# Altium schematic sheet Connection_of_encoders.SchDoc
size A4; SheetNumber: 3; SheetTotal: 6
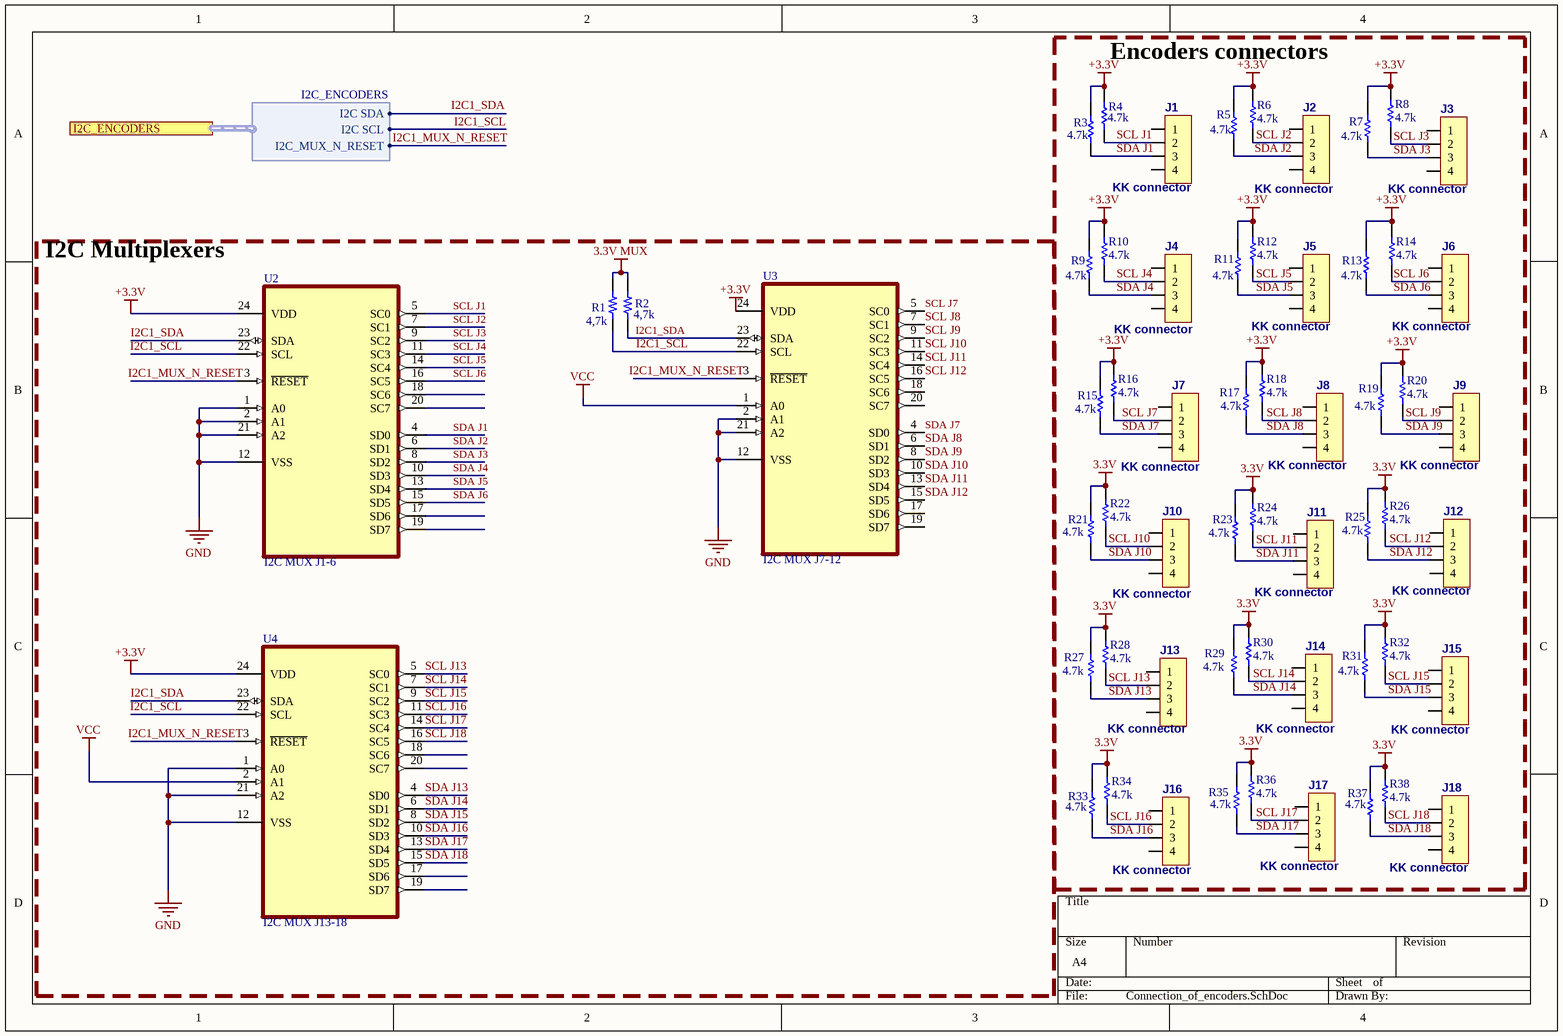
[diagram p0: Connection_of_encoders.SchDoc]

## Parts
J1  KK connector  [KK/2.54/4]
J2  KK connector  [KK/2.54/4]
J3  KK connector  [KK/2.54/4]
J4  KK connector  [KK/2.54/4]
J5  KK connector  [KK/2.54/4]
J6  KK connector  [KK/2.54/4]
J7  KK connector  [KK/2.54/4]
J8  KK connector  [KK/2.54/4]
J9  KK connector  [KK/2.54/4]
J10  KK connector  [KK/2.54/4]
J11  KK connector  [KK/2.54/4]
J12  KK connector  [KK/2.54/4]
J13  KK connector  [KK/2.54/4]
J14  KK connector  [KK/2.54/4]
J15  KK connector  [KK/2.54/4]
J16  KK connector  [KK/2.54/4]
J17  KK connector  [KK/2.54/4]
J18  KK connector  [KK/2.54/4]
R1  4,7k  [RES 0603_1608]
R2  4,7k  [RES 0603_1608]
R3  4.7k  [RESC1609X50X30ML10T20]
R4  4.7k  [RESC1609X50X30ML10T20]
R5  4.7k  [RESC1609X50X30ML10T20]
R6  4.7k  [RESC1609X50X30ML10T20]
R7  4.7k  [RESC1609X50X30ML10T20]
R8  4.7k  [RESC1609X50X30ML10T20]
R9  4.7k  [RESC1609X50X30ML10T20]
R10  4.7k  [RESC1609X50X30ML10T20]
R11  4.7k  [RESC1609X50X30ML10T20]
R12  4.7k  [RESC1609X50X30ML10T20]
R13  4.7k  [RESC1609X50X30ML10T20]
R14  4.7k  [RESC1609X50X30ML10T20]
R15  4.7k  [RESC1609X50X30ML10T20]
R16  4.7k  [RESC1609X50X30ML10T20]
R17  4.7k  [RESC1609X50X30ML10T20]
R18  4.7k  [RESC1609X50X30ML10T20]
R19  4.7k  [RESC1609X50X30ML10T20]
R20  4.7k  [RESC1609X50X30ML10T20]
R21  4.7k  [RESC1609X50X30ML10T20]
R22  4.7k  [RESC1609X50X30ML10T20]
R23  4.7k  [RESC1609X50X30ML10T20]
R24  4.7k  [RESC1609X50X30ML10T20]
R25  4.7k  [RESC1609X50X30ML10T20]
R26  4.7k  [RESC1609X50X30ML10T20]
R27  4.7k  [RESC1609X50X30ML10T20]
R28  4.7k  [RESC1609X50X30ML10T20]
R29  4.7k  [RESC1609X50X30ML10T20]
R30  4.7k  [RESC1609X50X30ML10T20]
R31  4.7k  [RESC1609X50X30ML10T20]
R32  4.7k  [RESC1609X50X30ML10T20]
R33  4.7k  [RESC1609X50X30ML10T20]
R34  4.7k  [RESC1609X50X30ML10T20]
R35  4.7k  [RESC1609X50X30ML10T20]
R36  4.7k  [RESC1609X50X30ML10T20]
R37  4.7k  [RESC1609X50X30ML10T20]
R38  4.7k  [RESC1609X50X30ML10T20]
U2  I2C MUX J1-6  [SOP65P640X110-24N]
U3  I2C MUX J7-12  [SOP65P640X110-24N]
U4  I2C MUX J13-18  [SOP65P640X110-24N]

## Blocks framed on the sheet
Encoders connectors: J1-J18 R3-R38
I2C Multiplexers: R1 R2 U2-U4

## Ports
I2C_ENCODERS (harness I2C_ENCODERS, see Schield_elkapod[2B], Logic_controller[1B])

## Harnesses
I2C_ENCODERS: I2C SDA, I2C SCL, I2C_MUX_N_RESET

## Nets
3.3V: R21.2 R22.2 R23.2 R24.2 R25.2 R26.2 R27.2 R28.2 R29.2 R30.2 R31.2 R32.2 R33.2 R34.2 R35.2 R36.2 R37.2 R38.2
3.3V MUX: R1.1 R2.1
+3.3V: R3.2 R4.2 R5.2 R6.2 R7.2 R8.2 R9.2 R10.2 R11.2 R12.2 R13.2 R14.2 R15.2 R16.2 R17.2 R18.2 R19.2 R20.2 U2.24(VDD) U3.24(VDD) U4.24(VDD)
GND: U2.1(A0) U2.2(A1) U2.12(VSS) U2.21(A2) U3.2(A1) U3.12(VSS) U3.21(A2) U4.1(A0) U4.12(VSS) U4.21(A2)
VCC: U3.1(A0) U4.2(A1)
I2C1_MUX_N_RESET: U2.3(~{RESET}) U3.3(~{RESET}) U4.3(~{RESET}) ; port I2C_ENCODERS.I2C_MUX_N_RESET
I2C1_SCL: R1.2 U2.22(SCL) U3.22(SCL) U4.22(SCL) ; port I2C_ENCODERS.I2C SCL
I2C1_SDA: R2.2 U2.23(SDA) U3.23(SDA) U4.23(SDA) ; port I2C_ENCODERS.I2C SDA
SCL J1: J1.2 R4.1 U2.5(SC0)
SCL J2: J2.2 R6.1 U2.7(SC1)
SCL J3: J3.2 R8.1 U2.9(SC2)
SCL J4: J4.2 R10.1 U2.11(SC3)
SCL J5: J5.2 R12.1 U2.14(SC4)
SCL J6: J6.2 R14.1 U2.16(SC5)
SCL J7: J7.2 R16.1 U3.5(SC0)
SCL J8: J8.2 R18.1 U3.7(SC1)
SCL J9: J9.2 R20.1 U3.9(SC2)
SCL J10: J10.2 R22.1 U3.11(SC3)
SCL J11: J11.2 R24.1 U3.14(SC4)
SCL J12: J12.2 R26.1 U3.16(SC5)
SCL J13: J13.2 R28.1 U4.5(SC0)
SCL J14: J14.2 R30.1 U4.7(SC1)
SCL J15: J15.2 R32.1 U4.9(SC2)
SCL J16: J16.2 R34.1 U4.11(SC3)
SCL J17: J17.2 R36.1 U4.14(SC4)
SCL J18: J18.2 R38.1 U4.16(SC5)
SDA J1: J1.3 R3.1 U2.4(SD0)
SDA J2: J2.3 R5.1 U2.6(SD1)
SDA J3: J3.3 R7.1 U2.8(SD2)
SDA J4: J4.3 R9.1 U2.10(SD3)
SDA J5: J5.3 R11.1 U2.13(SD4)
SDA J6: J6.3 R13.1 U2.15(SD5)
SDA J7: J7.3 R15.1 U3.4(SD0)
SDA J8: J8.3 R17.1 U3.6(SD1)
SDA J9: J9.3 R19.1 U3.8(SD2)
SDA J10: J10.3 R21.1 U3.10(SD3)
SDA J11: J11.3 R23.1 U3.13(SD4)
SDA J12: J12.3 R25.1 U3.15(SD5)
SDA J13: J13.3 R27.1 U4.4(SD0)
SDA J14: J14.3 R29.1 U4.6(SD1)
SDA J15: J15.3 R31.1 U4.8(SD2)
SDA J16: J16.3 R33.1 U4.10(SD3)
SDA J17: J17.3 R35.1 U4.13(SD4)
SDA J18: J18.3 R37.1 U4.15(SD5)

Not connected (* = marked no-connect by the designer): J1 1 4; J2 1 4; J3 1 4; J4 1 4; J5 1 4; J6 1 4; J7 1 4; J8 1 4; J9 1 4; J10 1 4; J11 1 4; J12 1 4; J13 1 4; J14 1 4; J15 1 4; J16 1 4; J17 1 4; J18 1 4; U2 17(SD6) 18(SC6) 19(SD7) 20(SC7); U3 17(SD6) 18(SC6) 19(SD7) 20(SC7); U4 17(SD6) 18(SC6) 19(SD7) 20(SC7)

## Library data of the parts
J1-J18 = CN_4x1: Connector: PCB-cable; KK; socket; male; PIN:4; straight/right-angle; tinned; THT
R1 R2 = RNCS0603BKE10K0: RES 4,7K OHM 1% 0,1W 0603; Manufacturer: Stackpole Electronics Inc; Power (Watts): 0.063W, 1/16W; Temperature Coefficient: ±25ppm/°C; Tolerance: ±0.1%; Part Number: RNCS0603BKE10K0; Value: 4,7k; Composition: Thin Film; Device Package: 0603 (1608 Metric); Features: Anti-Corrosive, Automotive AEC-Q200, Moisture Resistant; Height - Seated (Max): 0.022" (0.55mm); LastUpdated: 09.02.2024 20:43:37; Lifecycle Status: Active; Minimum Order: 1; Number of Terminations: 2; Operating Temperature: -55°C ~ 155°C; Package / Case: 0603 (1608 Metric); Packaging: TapeAndReel; PartId: 4838; Part Status: Active; Price: 0.06; Ratings: AEC-Q200; Resistance: 4,7k; Series: RNCS; Size / Dimension: 0.061" L x 0.031" W (1.55mm x 0.80mm); Supplier Device Package: 0603
R3-R38 = CMP-2000-03860-1: RES 4,7K OHM 1% 0,1W 0603 RNCS0603BKE10K0; Part Number: CRCW060311K0FKEA; Manufacturer: Vishay Dale
U2 U3 = CMP-020-000000-2: Translating Multiplexer Interface 24-TSSOP PCA9547PW,118; MF: NXP USA; Component Type: Standard; Availability: Unavailable; Pin Count: 24; Package: TSSOP-24 NXP Semiconductors; Source: SnapEDAsch.SchLib; Price: None; SnapEDA_Link: https://www.snapeda.com/parts/PCA9547PW,118/NXP%20USA%20Inc./view-part/571417/?ref=snap; Design Item ID: PCA9547PW,118; MP: PCA9547PW,118; Value: *
U4 = CMP-020-000000-2: Translating Multiplexer Interface 24-TSSOP PCA9547PW; MF: NXP USA; Component Type: Standard; Availability: Unavailable; Pin Count: 24; Package: TSSOP-24 NXP Semiconductors; Source: SnapEDAsch.SchLib; Price: None; SnapEDA_Link: https://www.snapeda.com/parts/PCA9547PW,118/NXP%20USA%20Inc./view-part/571417/?ref=snap; Design Item ID: PCA9547PW,118; MP: PCA9547PW,118; Value: *